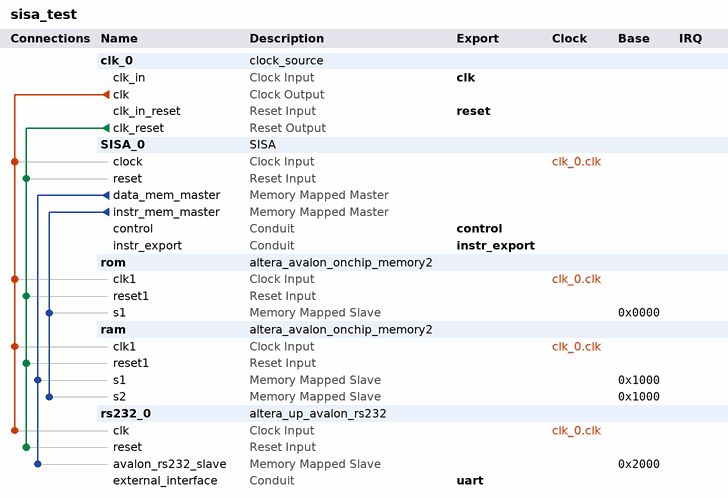
[diagram p0: system contents]
# Platform Designer (Qsys) system sisa_test, Cyclone V 5CSEMA5F31C6
# Parameters at their usual value, and those the tool derives, are not listed.
package require -exact qsys 18.1
create_system sisa_test
set_project_property DEVICE_FAMILY {Cyclone V}
set_project_property DEVICE 5CSEMA5F31C6

add_instance clk_0 clock_source 18.1
set_instance_parameter_value clk_0 clockFrequency 50000000

add_instance SISA_0 SISA 1.0

add_instance rom altera_avalon_onchip_memory2 18.1
set_instance_parameter_value rom dataWidth 32
set_instance_parameter_value rom dualPort false
set_instance_parameter_value rom initMemContent true
set_instance_parameter_value rom initializationFileName /home/josfemova-rs/REPOSITORIES/CE4302/proyecto1/software/bootloader/output_files/bootrom.hex
set_instance_parameter_value rom memorySize 4096
set_instance_parameter_value rom resetrequest_enabled false
set_instance_parameter_value rom useNonDefaultInitFile true
set_instance_parameter_value rom writable false

add_instance ram altera_avalon_onchip_memory2 18.1
set_instance_parameter_value ram dataWidth 32
set_instance_parameter_value ram dualPort true
set_instance_parameter_value ram initMemContent false
set_instance_parameter_value ram initializationFileName /home/josfemova-rs/REPOSITORIES/CE4302/proyecto1/software/bootloader/output_files/bootrom.hex
set_instance_parameter_value ram memorySize 4096
set_instance_parameter_value ram readDuringWriteMode OLD_DATA
set_instance_parameter_value ram resetrequest_enabled false
set_instance_parameter_value ram singleClockOperation true

add_instance rs232_0 altera_up_avalon_rs232 17.1
set_instance_parameter_value rs232_0 baud 115200
set_instance_parameter_value rs232_0 parity None

# connections
add_connection clk_0.clk ram.clk1 clock
add_connection clk_0.clk rom.clk1 clock
add_connection clk_0.clk rs232_0.clk clock
add_connection clk_0.clk SISA_0.clock clock
add_connection clk_0.clk_reset ram.reset1 reset
add_connection clk_0.clk_reset rom.reset1 reset
add_connection clk_0.clk_reset rs232_0.reset reset
add_connection clk_0.clk_reset SISA_0.reset reset
add_connection SISA_0.data_mem_master ram.s1 avalon
set_connection_parameter_value SISA_0.data_mem_master/ram.s1 baseAddress 0x1000
add_connection SISA_0.data_mem_master rs232_0.avalon_rs232_slave avalon
set_connection_parameter_value SISA_0.data_mem_master/rs232_0.avalon_rs232_slave baseAddress 0x2000
add_connection SISA_0.instr_mem_master ram.s2 avalon
set_connection_parameter_value SISA_0.instr_mem_master/ram.s2 baseAddress 0x1000
add_connection SISA_0.instr_mem_master rom.s1 avalon
set_connection_parameter_value SISA_0.instr_mem_master/rom.s1 baseAddress 0x0000

# exported interfaces
add_interface clk clock sink
set_interface_property clk EXPORT_OF clk_0.clk_in
add_interface control conduit end
set_interface_property control EXPORT_OF SISA_0.control
add_interface instr_export conduit end
set_interface_property instr_export EXPORT_OF SISA_0.instr_export
add_interface reset reset sink
set_interface_property reset EXPORT_OF clk_0.clk_in_reset
add_interface uart conduit end
set_interface_property uart EXPORT_OF rs232_0.external_interface

set_interconnect_requirement {$system} qsys_mm.clockCrossingAdapter HANDSHAKE
set_interconnect_requirement {$system} qsys_mm.enableEccProtection FALSE
set_interconnect_requirement {$system} qsys_mm.insertDefaultSlave FALSE
set_interconnect_requirement {$system} qsys_mm.maxAdditionalLatency 1

save_system sisa_test.qsys
